# Altium schematic sheet STM32_microcontroller_Power.SchDoc: STM32 microcontroller Power
size A4; CompanyName: STMicroelectronics; Organization: Microcontrollers Division; DocumentNumber: 5; SheetNumber: 4; SheetTotal: 19
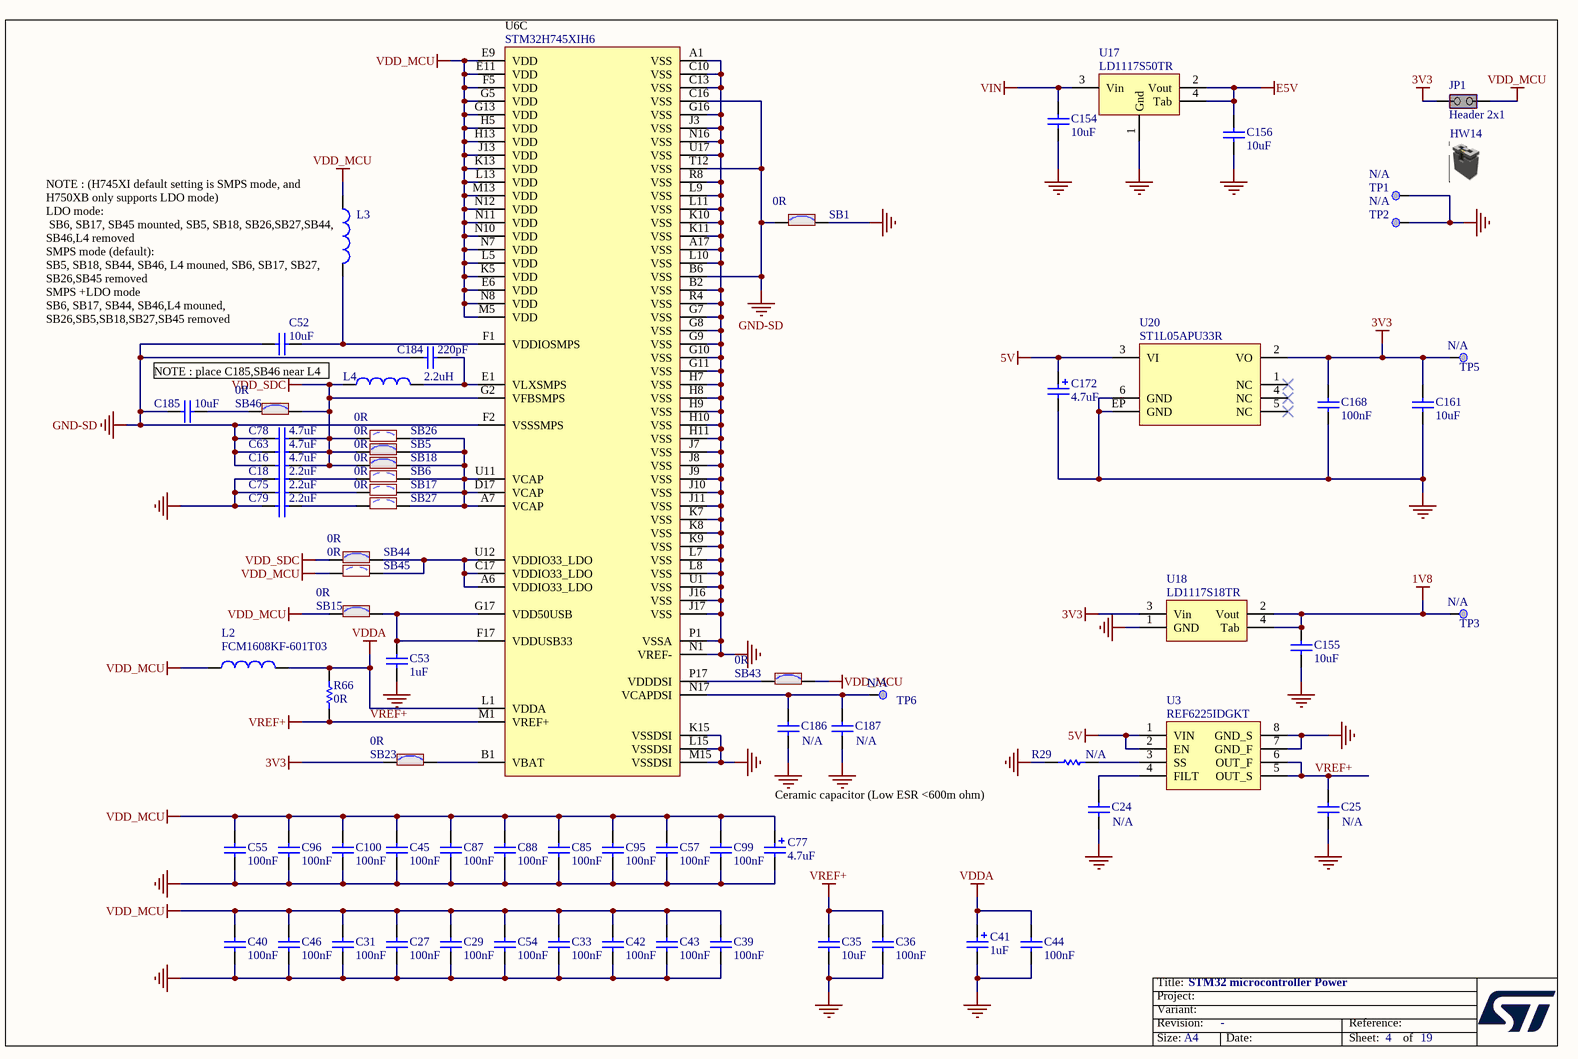
[diagram p0: STM32_microcontroller_Power.SchDoc]

## Parts
C16  value 4.7uF  [C0402]  (hidden comment: Capacitor)
C18  value 2.2uF  [C0603]  (hidden comment: Capacitor)
C24  N/A  [C0603]
C25  N/A  [C1210]
C27  value 100nF  [C0402]  (hidden comment: Capacitor)
C29  value 100nF  [C0402]  (hidden comment: Capacitor)
C31  value 100nF  [C0402]  (hidden comment: Capacitor)
C33  value 100nF  [C0402]  (hidden comment: Capacitor)
C35  value 10uF  [C0805]  (hidden comment: Capacitor)
C36  value 100nF  [C0402]  (hidden comment: Capacitor)
C39  value 100nF  [C0402]  (hidden comment: Capacitor)
C40  value 100nF  [C0402]  (hidden comment: Capacitor)
C41  value 1uF  [CPOL_VISHAY_TANTAL-595D_1407_H220]  (hidden comment: Cap_POL_TANA)
C42  value 100nF  [C0402]  (hidden comment: Capacitor)
C43  value 100nF  [C0402]  (hidden comment: Capacitor)
C44  value 100nF  [C0402]  (hidden comment: Capacitor)
C45  value 100nF  [C0402]  (hidden comment: Capacitor)
C46  value 100nF  [C0402]  (hidden comment: Capacitor)
C52  value 10uF  [C0402]  (hidden comment: Capacitor)
C53  value 1uF  [C0603]  (hidden comment: Capacitor)
C54  value 100nF  [C0402]  (hidden comment: Capacitor)
C55  value 100nF  [C0402]  (hidden comment: Capacitor)
C57  value 100nF  [C0402]  (hidden comment: Capacitor)
C63  value 4.7uF  [C0402]  (hidden comment: Capacitor)
C75  value 2.2uF  [C0603]  (hidden comment: Capacitor)
C77  value 4.7uF  [CPOL_VISHAY_TANTAL-595D_1407_H220]  (hidden comment: Cap_POL_TANA)
C78  value 4.7uF  [C0402]  (hidden comment: Capacitor)
C79  value 2.2uF  [C0603]  (hidden comment: Capacitor)
C85  value 100nF  [C0402]  (hidden comment: Capacitor)
C87  value 100nF  [C0402]  (hidden comment: Capacitor)
C88  value 100nF  [C0402]  (hidden comment: Capacitor)
C95  value 100nF  [C0402]  (hidden comment: Capacitor)
C96  value 100nF  [C0402]  (hidden comment: Capacitor)
C99  value 100nF  [C0402]  (hidden comment: Capacitor)
C100  value 100nF  [C0402]  (hidden comment: Capacitor)
C154  value 10uF  [C0805]  (hidden comment: Capacitor)
C155  value 10uF  [C0805]  (hidden comment: Capacitor)
C156  value 10uF  [C0805]  (hidden comment: Capacitor)
C161  value 10uF  [C0805]  (hidden comment: Capacitor)
C168  value 100nF  [C0402]  (hidden comment: Capacitor)
C172  value 4.7uF  [CPOL_VISHAY_TANTAL-595D_1407_H220]  (hidden comment: Cap_POL_TANA)
C184  value 220pF  [C0402]  (hidden comment: Capacitor)
C185  value 10uF  [C0603]  (hidden comment: Capacitor)
C186  N/A  [C0603]
C187  N/A  [C0402]
HW14  Shunt 2.54mm  [N/A]  (value not drawn)  (mechanical)
JP1  value Header 2x1  [CON_SAMTEC_TSW-102-07-G-S]  (hidden comment: Shunt Fitted)
L2  Manufacturer_Part_Number: FCM1608KF-601T03  [L0603]  (hidden comment: BEAD)
L3  Inductor  [IND_TAIYO-YUDEN_FBMJ1608]  (value not drawn)
L4  value 2.2uH  [IND_2016_MURATA_LQM2MPN2R2NG0]
R29  N/A  [R0402]
R66  value 0R  [R0603]  (hidden comment: Resistor)
SB1  value 0R  [SOLDER-BRIDGE_R0603-0R]  (hidden comment: SB_ON)
SB5  value 0R  [SOLDER-BRIDGE_R0603-0R]  (hidden comment: SB_ON)
SB6  value 0R  [SOLDER-BRIDGE_R0603-0R]  (hidden comment: SB_OFF)
SB15  value 0R  [SOLDER-BRIDGE_R0603-0R]  (hidden comment: SB_ON)
SB17  value 0R  [SOLDER-BRIDGE_R0603-0R]  (hidden comment: SB_OFF)
SB18  value 0R  [SOLDER-BRIDGE_R0603-0R]  (hidden comment: SB_ON)
SB23  value 0R  [SOLDER-BRIDGE_R0603-0R]  (hidden comment: SB_ON)
SB26  value 0R  [SOLDER-BRIDGE_R0603-0R]  (hidden comment: SB_OFF)
SB27  value 0R  [SOLDER-BRIDGE_R0603-0R]  (hidden comment: SB_OFF)
SB43  value 0R  [SOLDER-BRIDGE_R0603-0R]  (hidden comment: SB_ON)
SB44  value 0R  [SOLDER-BRIDGE_R0603-0R]  (hidden comment: SB_ON)
SB45  value 0R  [SOLDER-BRIDGE_R0603-0R]  (hidden comment: SB_OFF)
SB46  value 0R  [SOLDER-BRIDGE_R0603-0R]  (hidden comment: SB_ON)
TP1  Test Point  [TP_SMD_0-3MM]  (value not drawn)  (no BOM)
TP2  Test Point  [TP_SMD_0-3MM]  (value not drawn)  (no BOM)
TP3  Test Point  [TP_SMD_0-3MM]  (value not drawn)  (no BOM)
TP5  Test Point  [TP_SMD_0-3MM]  (value not drawn)  (no BOM)
TP6  Test Point  [TP_SMD_0-3MM]  (value not drawn)  (no BOM)
U3  value REF6225IDGKT  [ICC_VSSOP8_DGK_S-PDSO-G8_3X3_P065]
U6  value STM32H745XIH6  [ICC_TFBGA240+25_14X14_STM32H745H6U_P080]  (part C of 3)
U17  LD1117S50TR  [REG_SOT223-TAB]
U18  value LD1117S18TR  [REG_SOT223-TAB]
U20  ST1L05APU33R  [ICC_DFN6-EPAD_3X3_P095]

## Nets
1V8: C155.2 TP3.1 U18.2(Vout) U18.4(Tab)
3V3: C161.2 C168.1 JP1.2(NO) SB23.1 TP5.1 U18.3(Vin) U20.2(VO)
5V: C172.1 U3.1(VIN) U3.2(EN) U20.3(VI)
E5V: C156.2 U17.2(Vout) U17.4(Tab)
GND: C18.1 C24.1 C25.1 C27.1 C29.1 C31.1 C33.1 C35.1 C36.1 C39.1 C40.1 C41.2 C42.1 C43.1 C44.1 C45.1 C46.1 C53.1 C54.1 C55.1 C57.1 C75.1 C77.2 C79.1 C85.1 C87.1 C88.1 C95.1 C96.1 C99.1 C100.1 C154.1 C155.1 C156.1 C161.1 C168.2 C172.2 C186.1 C187.1 R29.1 SB1.2 TP1.1 TP2.1 U3.7(GND_F) U3.8(GND_S) U6.A1(VSS) U6.A17(VSS) U6.B2(VSS) U6.C10(VSS) U6.C13(VSS) U6.G7(VSS) U6.G8(VSS) U6.G9(VSS) U6.G10(VSS) U6.G11(VSS) U6.G16(VSS) U6.H7(VSS) U6.H8(VSS) U6.H9(VSS) U6.H10(VSS) U6.H11(VSS) U6.J3(VSS) U6.J7(VSS) U6.J8(VSS) U6.J9(VSS) U6.J10(VSS) U6.J11(VSS) U6.J16(VSS) U6.J17(VSS) U6.K7(VSS) U6.K8(VSS) U6.K9(VSS) U6.K10(VSS) U6.K11(VSS) U6.K15(VSSDSI) U6.L7(VSS) U6.L8(VSS) U6.L9(VSS) U6.L10(VSS) U6.L11(VSS) U6.L15(VSSDSI) U6.M15(VSSDSI) U6.N1(VREF-) U6.N16(VSS) U6.P1(VSSA) U6.R4(VSS) U6.R8(VSS) U6.U1(VSS) U6.U17(VSS) U17.1(Gnd) U18.1(GND) U20.6(GND) U20.EP(GND)
GND-SD: C16.2 C52.1 C63.2 C78.2 C184.1 C185.1 SB1.1 U6.B6(VSS) U6.C16(VSS) U6.F2(VSSSMPS) U6.T12(VSS)
VDD_MCU: C27.2 C29.2 C31.2 C33.2 C39.2 C40.2 C42.2 C43.2 C45.2 C46.2 C54.2 C55.2 C57.2 C77.1 C85.2 C87.2 C88.2 C95.2 C96.2 C99.2 C100.2 JP1.1(COMMON) L2.1 L3.1 SB15.1 SB43.2 SB45.1 U6.E6(VDD) U6.E9(VDD) U6.E11(VDD) U6.F5(VDD) U6.G5(VDD) U6.G13(VDD) U6.H5(VDD) U6.H13(VDD) U6.J13(VDD) U6.K5(VDD) U6.K13(VDD) U6.L5(VDD) U6.L13(VDD) U6.M5(VDD) U6.M13(VDD) U6.N7(VDD) U6.N8(VDD) U6.N10(VDD) U6.N11(VDD) U6.N12(VDD)
VDD_SDC: C16.1 C63.1 C78.1 L4.1 SB5.1 SB18.1 SB26.1 SB44.1 SB46.2 U6.G2(VFBSMPS)
VDDA: C41.1 C44.2 L2.2 R66.1 U6.L1(VDDA)
VIN: C154.2 U17.3(Vin)
VREF+: C25.2 C35.2 C36.2 R66.2 U3.5(OUT_S) U3.6(OUT_F) U6.M1(VREF+)
NetC18_2: C18.2 SB6.1
NetC24_2: C24.2 U3.4(FILT)
NetC52_2: C52.2 L3.2 U6.F1(VDDIOSMPS)
NetC53_2: C53.2 SB15.2 U6.F17(VDDUSB33) U6.G17(VDD50USB)
NetC75_2: C75.2 SB17.1
NetC79_2: C79.2 SB27.1
NetC184_2: C184.2 L4.2 U6.E1(VLXSMPS)
NetC185_2: C185.2 SB46.1
NetC186_2: C186.2 C187.2 TP6.1 U6.N17(VCAPDSI)
NetR29_2: R29.2 U3.3(SS)
NetSB5_2: SB5.2 SB6.2 SB17.2 SB18.2 SB26.2 SB27.2 U6.A7(VCAP) U6.D17(VCAP) U6.U11(VCAP)
NetSB23_2: SB23.2 U6.B1(VBAT)
NetSB43_1: SB43.1 U6.P17(VDDDSI)
NetSB44_2: SB44.2 SB45.2 U6.A6(VDDIO33_LDO) U6.C17(VDDIO33_LDO) U6.U12(VDDIO33_LDO)

Not connected (* = marked no-connect by the designer): U20 1(NC)* 4(NC)* 5(NC)*

## Notes on the sheet
- (near L3) NOTE : (H745XI default setting is SMPS mode, and H750XB only supports LDO mode)
  LDO mode:
  SB6, SB17, SB45 mounted, SB5, SB18, SB26,SB27,SB44, SB46,L4 removed
  SMPS mode (default):
  SB5, SB18, SB44, SB46, L4 mouned, SB6, SB17, SB27, SB26,SB45 removed
  SMPS +LDO mode
  SB6, SB17, SB44, SB46,L4 mouned, SB26,SB5,SB18,SB27,SB45 removed
- NOTE : place C185,SB46 near L4
- Ceramic capacitor (Low ESR <600m ohm)
- Title:
- Project:
- Size:
- Revision:
- Variant:
- A4
- -
- Date:
- Reference:
- Sheet:
- of

## Library data of the parts
C16 C63 C78 = MCD-01356: Capacitor, MLCC, 4.7uF, 6V3, X5R, 20%, 0402, T=0,5mm; Manufacturer_Part_Number: GRM155R60J475ME47; Manufacturer: MURATA; Part_Preference: Recommended; Provided_By: Subcon; Initial_Board_Reference: MB1372; Component_Country_Of_Origin: Japan°°; ID: 3456; Order_Code_RS: 814-5230; ShowFields: YES; Internal_Part_Number: MCD-01356; ComponentLink1Description: Datasheet; Status: Released; Part_Type: Capacitor; Package: 0402; ComponentLink1URL: http://tunmcdsvn.tun.st.com/Component_Documentation_Library/Trunk/Capacitor/MURATA_GRM_Series; Order_Code_Digikey: 490-5915-1-ND; Order_Code_Farnell: 2666407
C18 C75 C79 C186 = MCD-00012: Capacitor, MLCC, 2.2uF, 10V, X5R, 10%, 0603, T=0,8mm; Manufacturer_Part_Number: CC0603KRX5R6BB225; Manufacturer: YAGEO; Alternate_Manufacturer_Part_Number: C0603C225K8PACTU; Alternate_Manufacturer: KEMET; BMS_Part_Number: 9142010; Part_Preference: Recommended; Partial_Alternate_Internal_Part_Number: MCD-00551; Provided_By: Subcon; Initial_Board_Reference: MB1274; Component_Country_Of_Origin: China; ID: 2467; Order_Code_RS: 2370679; ShowFields: YES; Internal_Part_Number: MCD-00012; Status: Released; Part_Type: Capacitor; Package: 0603; ComponentLink1Description: Yageo_Capacitor_X5R-series.pdf; ComponentLink1URL: http://tunmcdsvn.tun.st.com/Component_Documentation_Library/Trunk/Capacitor/YAGEO_X5R_Series; ECCN_US: n/a; ECCN_EU: n/a; Order_Code_Digikey: 311-1451-1-ND; Order_Code_Farnell: 2370679
  C186: Value: 2.2uF
C24 C53 = MCD-00010: Capacitor, MLCC, 1uF, 16V, X5R, 10%, 0603, T=0,8mm; Manufacturer_Part_Number: CC0603KRX5R7BB105; Manufacturer: YAGEO; Part_Preference: Recommended; Provided_By: Subcon; Initial_Board_Reference: mb1274; Component_Country_Of_Origin: China; ID: 2470; Order_Code_RS: 2370680; ShowFields: YES; Internal_Part_Number: MCD-00010; Status: Released; Part_Type: Capacitor; Package: 0603; ComponentLink1Description: Yageo_Capacitor_X5R-series.pdf; ComponentLink1URL: http://tunmcdsvn.tun.st.com/Component_Documentation_Library/Trunk/Capacitor/YAGEO_X5R_Series; ECCN_US: n/a; ECCN_EU: n/a; Order_Code_Digikey: 311-1444-1-ND; Order_Code_Farnell: 2370680
  C24: Value: 1uF
C25 = MCD-00614: Capacitor, MLCC, 22uF, 16V, 1210, X7R, 20%, T=2,5mm, ESR 2mohm@410KHz; Manufacturer_Part_Number: GCM32ER71C226ME19; Manufacturer: MURATA; Part_Preference: Recommended; Provided_By: Subcon; Initial_Board_Reference: MB1331; Component_Country_Of_Origin: Japan°°; ID: 3130; ShowFields: YES; Internal_Part_Number: MCD-00614; Value: 22uF; Status: Released; Part_Type: Capacitor; Package: 1210; ComponentLink1Description: Murata_22uF_1210_GCM32ER71C226ME19.pdf; ComponentLink1URL: http://tunmcdsvn.tun.st.com/Component_Documentation_Library/Trunk/Capacitor/MURATA_GC_Series; Order_Code_Digikey: 490-14539-1-ND; Order_Code_Farnell: N/A; Order_Code_RS: N/A
C27 C29 C31 C33 C36 C39 C40 C42-C46 C54 C55 C57 C85 C87 C88 C95 C96 C99 C100 C168 C187 = MCD-00006: Capacitor, MLCC, 100nF, 16V, X7R, +/-10%, 0402, T=0.5mm; Manufacturer_Part_Number: CC0402KRX7R7BB104; Manufacturer: YAGEO; Part_Preference: Recommended; Partial_Alternate_Internal_Part_Number: MCD-03299; Component_Country_Of_Origin: China; ID: 2474; Order_Code_RS: 9402047; ShowFields: YES; Internal_Part_Number: MCD-00006; Status: Released; Part_Type: Capacitor; Package: 0402; ComponentLink1URL: http://tunmcdsvn.tun.st.com/Component_Documentation_Library/Trunk/Capacitor/YAGEO_X7R_Series; Order_Code_Digikey: 311-1338-1-ND; Order_Code_Farnell: 9402047
  C187: Value: 100nF
C35 C154-C156 C161 = MCD-00014: Capacitor, MLCC, 10uF, 25V, X5R, 10%, 0805, T=0,85mm; Manufacturer_Part_Number: CC0805KRX5R8BB106; Manufacturer: YAGEO; Full_Alternate_Internal_Part_Number: MCD-02385; Part_Preference: Recommended; Partial_Alternate_Internal_Part_Number: MCD-03053; Provided_By: Subcon; Initial_Board_Reference: mb1274; Component_Country_Of_Origin: China; ID: 2468; ShowFields: YES; Internal_Part_Number: MCD-00014; ECCN_US: n/a; ECCN_EU: n/a; ComponentLink1Description: Yageo_Capacitor_X5R-series.pdf; Status: Released; Part_Type: Capacitor; Package: 0805; ComponentLink1URL: http://tunmcdsvn.tun.st.com/Component_Documentation_Library/Trunk/Capacitor/YAGEO_X5R_Series; Order_Code_Digikey: 311-3503-1-ND; Order_Code_Farnell: N/A; Order_Code_RS: N/A
C41 = MCD-00594: Capacitor, Tantalum, 1uF, 35V, +/-10%, 595D case A; Manufacturer_Part_Number: 595D105X9035A2T; Manufacturer: VISHAY; Part_Preference: Recommended; Order_Code_RS: 117-404; Provided_By: Subcon; Initial_Board_Reference: MB1331; Component_Country_Of_Origin: Israel; ID: 3150; ShowFields: YES; Revision: July-2002: Re-released for DXP Platform.; Internal_Part_Number: MCD-00594; Status: Released; Part_Type: Capacitor; ComponentLink1Description: VISHAY_CAPACITOR_TANTALUM_595D.pdf; ComponentLink1URL: http://tunmcdsvn.tun.st.com/Component_Documentation_Library/Trunk/Capacitor/VISHAY_595D_Series; Order_Code_Digikey: 595D105X9035A2T-ND; Order_Code_Farnell: 1166819; Package: 3718 (metric)
C52 = MCD-01355: Capacitor, MLCC, 10uF, 4V, X5R, 20%, 0402, T=0,5mm; Manufacturer_Part_Number: GRM155R60G106ME44; Manufacturer: MURATA; Part_Preference: Recommended; Partial_Alternate_Internal_Part_Number: MCD-01716, MCD-02999; Provided_By: Subcon; Initial_Board_Reference: MB1372; Component_Country_Of_Origin: Japan°°; ID: 3455; Order_Code_RS: 172-6477; ShowFields: YES; Internal_Part_Number: MCD-01355; ComponentLink1Description: Datasheet; Status: Released; Part_Type: Capacitor; Package: 0402; ComponentLink1URL: http://tunmcdsvn.tun.st.com/Component_Documentation_Library/Trunk/Capacitor/MURATA_GRM_Series; Order_Code_Digikey: 490-10693-1-ND; Order_Code_Farnell: 2611904
C77 C172 = MCD-00595: Capacitor, Tantalum, 4.7uF, 16V, +/-10%, 595D case A; Manufacturer_Part_Number: 595D475X9016A2T; Manufacturer: VISHAY; Part_Preference: Recommended; Order_Code_RS: 117-303; Provided_By: Subcon; Initial_Board_Reference: MB1331; Component_Country_Of_Origin: Israel; ID: 3146; ShowFields: YES; Revision: July-2002: Re-released for DXP Platform.; Internal_Part_Number: MCD-00595; Status: Released; Part_Type: Capacitor; ComponentLink1Description: VISHAY_CAPACITOR_TANTALUM_595D.pdf; ComponentLink1URL: http://tunmcdsvn.tun.st.com/Component_Documentation_Library/Trunk/Capacitor/VISHAY_595D_Series; Order_Code_Digikey: 595D475X9016A2T-ND; Order_Code_Farnell: 1166805; Package: 3718 (metric)
C184 = MCD-01225: Capacitor, MLCC, 220pF, 50V, NPO, 5%, 0402, T=0,5mm; Manufacturer_Part_Number: CC0402JRNPO9BN221; Manufacturer: YAGEO; Part_Preference: Recommended; Provided_By: Subcon; Initial_Board_Reference: MB1331; Component_Country_Of_Origin: China; ID: 3272; Order_Code_RS: 616-9284; ShowFields: YES; Internal_Part_Number: MCD-01225; Status: Released; Part_Type: Capacitor; Package: 0402; ComponentLink1Description: Datasheet; ComponentLink1URL: http://tunmcdsvn.tun.st.com/Component_Documentation_Library/Trunk/Capacitor/YAGEO_NP0_Series; Order_Code_Digikey: 311-1416-1-ND; Order_Code_Farnell: 3019240
C185 = MCD-01341: Capacitor, MLCC, 10uF, 6V3, X5R, 20%, 0603, T=0,8mm; Manufacturer_Part_Number: GRM188R60J106ME47D; Manufacturer: MURATA; Part_Preference: Recommended; Provided_By: Subcon; Initial_Board_Reference: MB1331; Component_Country_Of_Origin: Japan°°; ID: 3441; ShowFields: YES; Internal_Part_Number: MCD-01341; ComponentLink1Description: Datasheet; Status: Released; Part_Type: Capacitor; Package: 0603; ComponentLink1URL: http://tunmcdsvn.tun.st.com/Component_Documentation_Library/Trunk/Capacitor/MURATA_GRM_Series; Order_Code_Digikey: 490-3896-1-ND; Order_Code_Farnell: 1735528; Order_Code_RS: N/A
HW14 = MCD-00043: SHUNT 2.54mm BLACK; Manufacturer_Part_Number: SNT-100-BK-G; Manufacturer: SAMTEC; Full_Alternate_Internal_Part_Number: MCD-02388; Manufacturer_HQ_COO: Unknown; Part_Preference: Recommended; Part_Type: Misc; Partial_Alternate_Internal_Part_Number: MCD-01849, MCD-01864; Provided_By: Subcon; Alternate_EMS: A; Component_Country_Of_Origin: China, Costa Rica, Malaysia, USA, Vietnam; ID: 2551; Order_Code_RS: 158-7784; ShowFields: YES; Value: SNT-100-BK-G; Internal_Part_Number: MCD-00043; PartType: Mechanical; ECCN_US: n/a; ECCN_EU: n/a; ComponentLink1Description: Samtec_Shunt_Jumper_SNT100.pdf; ComponentLink1URL: http://tunmcdsvn.tun.st.com/Component_Documentation_Library/Trunk/Misc/SAMTEC_SNT-100-BK-G; Order_Code_Digikey: SAM8858-ND; Order_Code_Farnell: 2505007; Package: 2.54x5.08mm; Status: Released
JP1 = MCD-00683: Header, 2x1, 2.54mm, VR, TH, T=5.84mm/2.54mm; Part_Type: Connector; Manufacturer_Part_Number: TSW-102-07-G-S; Manufacturer: SAMTEC; Part_Preference: Recommended; Full_Alternate_Internal_Part_Number: MCD-02389; Partial_Alternate_Internal_Part_Number: MCD-02957, MCD-03720; Component_Country_Of_Origin: China, Costa Rica, Malaysia, USA, Vietnam; ID: 3057; Order_Code_RS: 155-5312; ShowFields: YES; Internal_Part_Number: MCD-00683; Status: Released; ComponentLink1URL: http://tunmcdsvn.tun.st.com/Component_Documentation_Library/Trunk/Connector/SAMTEC_TSW_Series/; Order_Code_Digikey: SAM1029-02-ND; Order_Code_Farnell: 2505044
L2 = MCD-00047: Ferrite bead, 600R @1 00MHz, +/-25%, 350mA, 0R5, 0603, T=0.8mm; Part_Type: Inductor; Manufacturer: TAI-TECH; Part_Preference: Recommended; Partial_Alternate_Internal_Part_Number: MCD-02959; Component_Country_Of_Origin: Unknown; ID: 2546; ShowFields: YES; Internal_Part_Number: MCD-00047; Value: 600R @ 100MHz; Status: Released; ComponentLink1URL: http://tunmcdsvn.tun.st.com/Component_Documentation_Library/Trunk/Inductor/TAI-TECH_FCM-1608_Series; Order_Code_Digikey: N/A; Order_Code_Farnell: N/A; Order_Code_RS: N/A; Package: 0603
L3 = MCD-01431: Ferrite bead, 18R @ 100MHz, +/-30%, 750mA, 0R004, 0603, T=1mm; Manufacturer_Part_Number: FBMJ1608HM180NTR; Manufacturer: TAIYO YUDEN; Part_Preference: Forbidden; ShowFields: YES; ID: 3531; Component_Country_Of_Origin: Unknown; Internal_Part_Number: MCD-01431; Value: 18R @ 100MHz; Status: Obsolete; Part_Type: Inductor; Package: 0603; ComponentLink1URL: http://tunmcdsvn.tun.st.com/Component_Documentation_Library/Trunk/Inductor/TAIYO_YUDEN_FB-M_Series; Order_Code_Digikey: 587-3251-1-ND; Order_Code_Farnell: 2860452; Order_Code_RS: N/A
L4 = MCD-01110: Inductor 2.2uH, 2x1.6x0.9mm; Manufacturer_Part_Number: LQM2MPN2R2NG0; Manufacturer: MURATA; Part_Preference: Recommended; Provided_By: Subcon; Initial_Board_Reference: MB1381; Component_Country_Of_Origin: Japan°°; ID: 3384; ShowFields: YES; Internal_Part_Number: MCD-01110; Status: Checked; Part_Type: Inductor; ComponentLink1Description: Murata_inductor_LQM2MPN.pdf; ComponentLink1URL: http://tunmcdsvn.tun.st.com/Component_Documentation_Library/Trunk/Inductor/MURATA_LQM_Series; ECCN_US: n/a; ECCN_EU: n/a; Order_Code_Digikey: 490-7786-1-ND; Order_Code_Farnell: 2470314; Order_Code_RS: N/A; Package: 0806
R29 = MCD-00166: Resistor,120K,0402,1%,1/16W; Manufacturer_Part_Number: RC0402FR-07120KL; Manufacturer: YAGEO; Part_Preference: Recommended; Provided_By: Subcon; Initial_Board_Reference: MB1264; Component_Country_Of_Origin: China; ID: 2703; ShowFields: YES; Internal_Part_Number: MCD-00166; Value: 120K; Status: Checked; Part_Type: Resistor; Package: 0402; ComponentLink1Description: Yageo_Resistor_RC0402-series.pdf; ComponentLink1URL: http://tunmcdsvn.tun.st.com/Component_Documentation_Library/Trunk/Resistor/YAGEO_RC_L_Series; ECCN_US: n/a; ECCN_EU: n/a; Order_Code_Digikey: 311-120KLRCT-ND; Order_Code_Farnell: 9239480; Order_Code_RS: N/A
R66 = MCD-00181: Resistor,0R,0603,ULO; Manufacturer_Part_Number: PMR03EZPJ000; Manufacturer: ROHM SEMICONDUCTOR; Part_Preference: Recommended; Provided_By: Subcon; Component_Country_Of_Origin: Philippines, Thailand°°; ID: 2691; ShowFields: YES; Internal_Part_Number: MCD-00181; Status: Released; Part_Type: Resistor; Package: 0603; ComponentLink1Description: ROHM_ULtra low Ohmic Resistor _PMR10EZPJ000.pdf; ComponentLink1URL: http://tunmcdsvn.tun.st.com/Component_Documentation_Library/Trunk/Resistor/ROHM_PMR_Series; ECCN_US: n/a; ECCN_EU: n/a; Order_Code_Digikey: PMR03EZPJ000-ND; Order_Code_Farnell: N/A; Order_Code_RS: N/A
SB1 SB5 SB15 SB18 SB23 SB43 SB44 SB46 = MCD-00071: Solder Bridge ON; Part_Type: Resistor; Manufacturer: YAGEO; Manufacturer_HQ_COO: Unknown; Manufacturer_Part_Number: RC0603JR-070RL; Part_Preference: Recommended; Provided_By: Subcon; Initial_Board_Reference: mb1274; Component_Country_Of_Origin: China; ID: 2521; Order_Code_RS: 199-5647; ShowFields: YES; Internal_Part_Number: MCD-00071; ECCN_US: n/a; ECCN_EU: n/a; Status: Released; ComponentLink1URL: http://tunmcdsvn.tun.st.com/Component_Documentation_Library/Trunk/Resistor/YAGEO_RC_Series; Order_Code_Digikey: 311-0.0GRTR-ND; Order_Code_Farnell: 2421846; Package: 0603
SB6 SB17 SB26 SB27 SB45 = MCD-00072: Solder Bridge OFF; Part_Type: Resistor; Manufacturer: YAGEO; Manufacturer_HQ_COO: Unknown; Manufacturer_Part_Number: RC0603JR-070RL; Part_Preference: Recommended; Initial_Board_Reference: mb1274; Component_Country_Of_Origin: China; ID: 2520; Order_Code_RS: 199-5647; ShowFields: YES; Internal_Part_Number: MCD-00072; Status: Released; ECCN_US: n/a; ECCN_EU: n/a; Provided_By: n/a; ComponentLink1URL: http://tunmcdsvn.tun.st.com/Component_Documentation_Library/Trunk/Resistor/YAGEO_RC_Series; Order_Code_Digikey: 311-0.0GRTR-ND; Order_Code_Farnell: 2421846; Package: 0603
TP1-TP3 TP5 TP6 = MCD-00630: Test Point 0.3mm; Part_Type: Misc; Part_Preference: Recommended; Initial_Board_Reference: MB1264; ID: 3115; ShowFields: YES; Component_Country_Of_Origin: Unknown; Internal_Part_Number: MCD-00630; Status: Released; ECCN_US: n/a; ECCN_EU: n/a; Provided_By: n/a; Manufacturer: N/A; Manufacturer_Part_Number: N/A; Order_Code_Digikey: N/A; Order_Code_Farnell: N/A; Order_Code_RS: N/A; Value: N/A; ComponentLink1URL: http://tunmcdsvn.tun.st.com/Component_Documentation_Library/Trunk; Manufacturer_HQ_COO: Unknown
U3 = MCD-01138: IC VREF SERIES 2.5V 8VSSOP; Manufacturer: TEXAS INSTRUMENTS; Part_Preference: Recommended; Provided_By: Subcon; Initial_Board_Reference: MB1381; Component_Country_Of_Origin: Thailand; ID: 3357; ShowFields: YES; Internal_Part_Number: MCD-01138; Status: Checked; Part_Type: IC; Manufacturer_Part_Number: REF6225IDGKT; Package: VSSOP-8; ComponentLink1Description: TI_REF_REF6225IDGKT; ComponentLink1URL: http://tunmcdsvn.tun.st.com/Component_Documentation_Library/Trunk/IC/TEXAS_INSTRUMENTS_REF6225IDGKT; ECCN_US: N/A; ECCN_EU: N/A; Order_Code_Digikey: 296-44922-2-ND; Order_Code_Farnell: N/A; Order_Code_RS: N/A
U6 = MCD-01085: 32bit MCU TFBGA240+25; Part_Type: IC; Manufacturer: STMICROELECTRONICS; BMS_Part_Number: 9175307; Manufacturer_HQ_COO: EU; Part_Preference: Recommended; Provided_By: STM; Initial_Board_Reference: MB1381; Component_Country_Of_Origin: Philippines; ID: 3408; ShowFields: YES; Internal_Part_Number: MCD-01085; Status: Checked; Manufacturer_Part_Number: STM32H745XIH6; Package: TFBGA-265; ComponentLink1Description: Datasheet; ComponentLink1URL: http://tunmcdsvn.tun.st.com/Component_Documentation_Library/Trunk/IC/STMICROELECTRONICS_STM32H745x; Order_Code_Digikey: 497-19502-ND; Order_Code_Farnell: 3365366; Order_Code_RS: N/A
U17 = MCD-00088: IC REG LDO 5V 0.8A SOT223; Manufacturer: STMICROELECTRONICS; BMS_Part_Number: 9176133; Manufacturer_HQ_COO: EU; Part_Preference: Recommended; ECCN_US: EAR99; ECCN_EU: NEC; Provided_By: Subcon; Initial_Board_Reference: mb1274; Component_Country_Of_Origin: China; ID: 2503; Order_Code_RS: 165-7748; ShowFields: YES; Internal_Part_Number: MCD-00088; Value: LD1117S50TR; Status: Released; Part_Type: IC; Manufacturer_Part_Number: LD1117S50TR; ComponentLink1Description: STM_LDO_LD1117.pdf; ComponentLink1URL: http://tunmcdsvn.tun.st.com/Component_Documentation_Library/Trunk/IC/STMICROELECTRONICS_LD1117S50TR; Order_Code_Digikey: 497-6447-2-ND; Order_Code_Farnell: 1467781; Package: SOT223-4
U18 = MCD-01070: Adjustable and fixed low drop positive voltage regulator; Part_Type: IC; Manufacturer: STMICROELECTRONICS; BMS_Part_Number: 9176180; Manufacturer_HQ_COO: EU; Part_Preference: Recommended; ECCN_US: EAR99; ECCN_EU: NEC; Provided_By: Subcon; Initial_Board_Reference: MB1381; Component_Country_Of_Origin: China; ID: 3422; Order_Code_RS: 686-9375; ShowFields: YES; Internal_Part_Number: MCD-01070; Status: Checked; Manufacturer_Part_Number: LD1117S18TR; Package: SOT-223; ComponentLink1Description: STM_LDO_LD1117S18TR.pdf; ComponentLink1URL: http://tunmcdsvn.tun.st.com/Component_Documentation_Library/Trunk/IC/STMICROELECTRONICS_LD1117S18TR; Order_Code_Digikey: 497-7308-2-ND; Order_Code_Farnell: 3367145
U20 = MCD-01127: IC REG LDO 3.3V 1.3A 6DFN; Manufacturer: STMICROELECTRONICS; BMS_Part_Number: 9176247; Manufacturer_HQ_COO: EU; Part_Preference: Recommended; ECCN_US: EAR99; ECCN_EU: NEC; Provided_By: Subcon; Initial_Board_Reference: MB1381; Component_Country_Of_Origin: Malaysia; ID: 3368; ShowFields: YES; Internal_Part_Number: MCD-01127; Value: ST1L05APU33R; Status: Released; Part_Type: IC; Manufacturer_Part_Number: ST1L05APU33R; Package: DFN-6; ComponentLink1Description: STM_LDO_ST1L05CPU33R.pdf; ComponentLink1URL: http://tunmcdsvn.tun.st.com/Component_Documentation_Library/Trunk/IC/STMICROELECTRONICS_ST1L05APU33R; Order_Code_Digikey: 497-8980-2-ND; Order_Code_Farnell: N/A; Order_Code_RS: N/A